# Altium schematic sheet 涂鸦灯串-20220817.SchDoc
size 508 x 342 mm
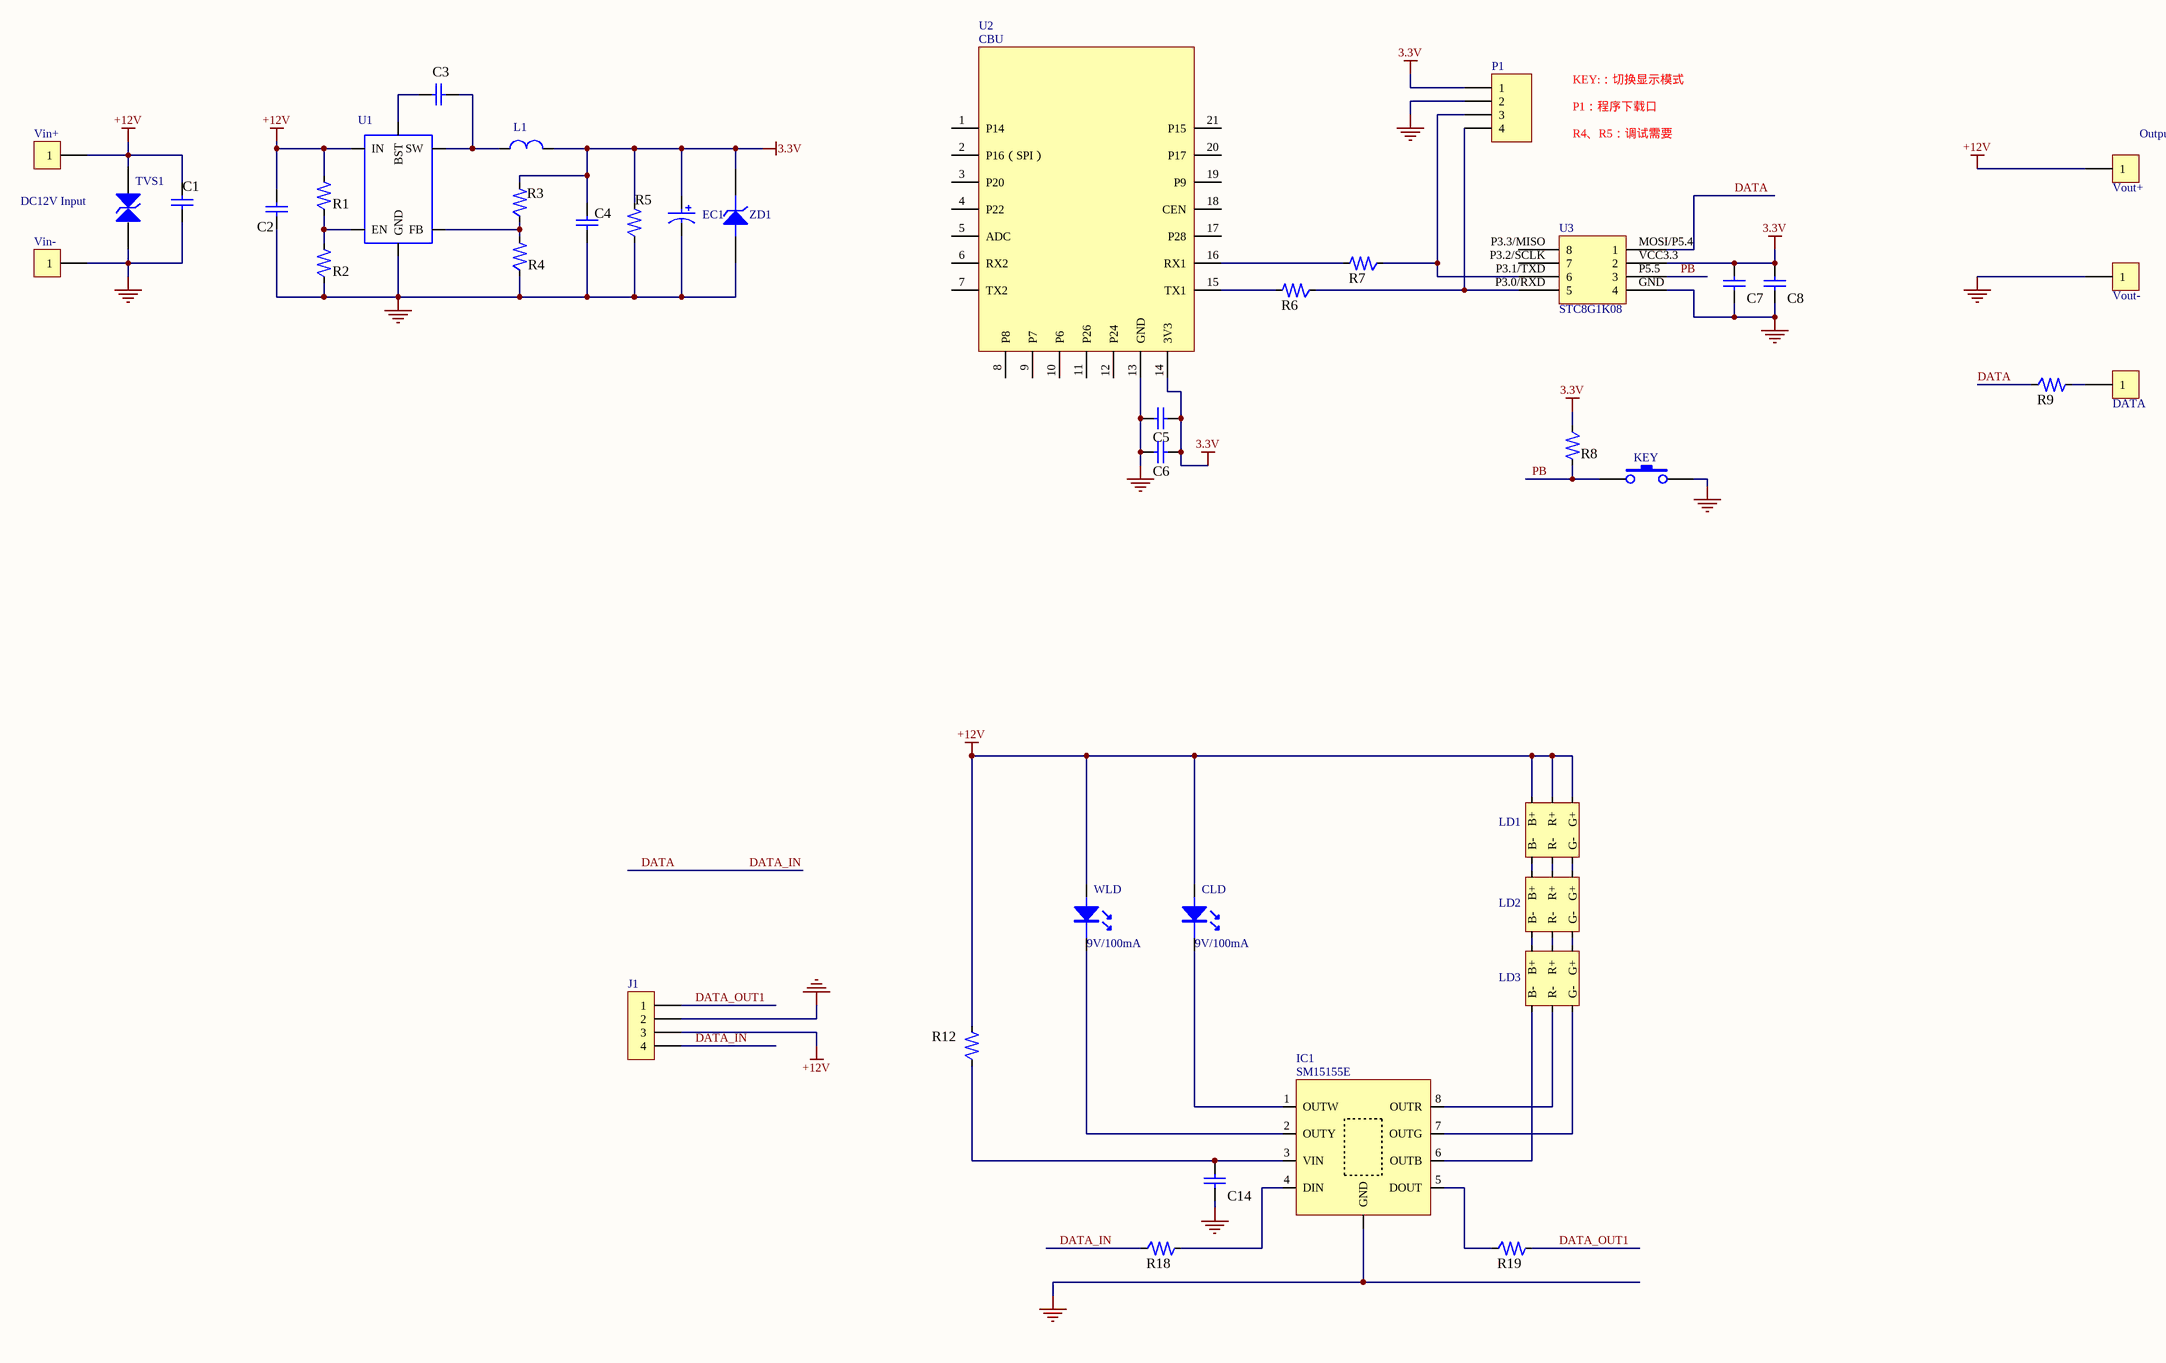
[diagram p0: 涂鸦灯串-20220817.SchDoc]

## Parts
C1  1206  [JR-1206-HC]  (value not drawn)
C2  1206  [JR-1206-HC]  (value not drawn)
C3  0805  [JR-0805-HC]  (value not drawn)
C4  0805  [JR-0805-HC]  (value not drawn)
C5  0805  [JR-0805-HC]  (value not drawn)
C6  0805  [JR-0805-HC]  (value not drawn)
C7  0805  [JR-0805-HC]  (value not drawn)
C8  0805  [JR-0805-HC]  (value not drawn)
C14  1206  [JR-1206-HC]  (value not drawn)
CLD  9V/100mA  [2835 LED-APT - CW]
DATA  CON1  [电线焊盘-1]  (value not drawn)
EC1  5*11  [JR-Φ6.3*11mm电解电容-3D]  (value not drawn)
IC1  SM15155E  [ESOP-8-3D]
J1  CON4  (value not drawn)
KEY  SW-PB  [6*6*15轻触开关-贴片]  (value not drawn)
L1  TRANSM  [VCD54]  (value not drawn)
LD1  RGB 3528  [Elega-2835-RGB-4-3D]  (value not drawn)
LD2  RGB 3528  [Elega-2835-RGB-4-3D]  (value not drawn)
LD3  RGB 3528  [Elega-2835-RGB-4-3D]  (value not drawn)
P1  Header 4H  [HDR1X4H]  (value not drawn)
R1  0805  [JR-0805-HR]  (value not drawn)
R2  0805  [JR-0805-HR]  (value not drawn)
R3  0805  [JR-0805-HR]  (value not drawn)
R4  0805  [JR-0805-HR]  (value not drawn)
R5  0805  [JR-0805-HR]  (value not drawn)
R6  0805  [JR-0805-HR]  (value not drawn)
R7  0805  [JR-0805-HR]  (value not drawn)
R8  0805  [JR-0805-HR]  (value not drawn)
R9  0805  [JR-0805-HR]  (value not drawn)
R12  1206  [JR-1206-HR]  (value not drawn)
R18  1206  [JR-0805-HR]  (value not drawn)
R19  1206  [JR-0805-HR]  (value not drawn)
TVS1  (no value)  [DO-214AC-W]
U1  MP2457GJ  [SOT23-6-3D]  (value not drawn)
U2  CBU  [CBU]
U3  STC8G1K08
Vin+  CON1  [电线焊盘-1]  (value not drawn)
Vin-  CON1  [电线焊盘-1]  (value not drawn)
Vout+  CON1  [电线焊盘-1]  (value not drawn)
Vout-  CON1  [电线焊盘-1]  (value not drawn)
WLD  9V/100mA  [2835 LED-APT - WW]
ZD1  (no value)  [SOD123]

## Nets
3.3V: C4.2 C5.2 C6.2 C7.2 C8.2 EC1.1 L1.2 P1.1 R3.1 R5.1 R8.2 U2.14(3V3) U3.VCC3.3(2) ZD1.2(K)
+12V: C1.1 C2.1 CLD.1 J1.3 LD1.1(G+) LD1.2(R+) LD1.3(B+) R1.1 R12.1 TVS1.2(K) U1.5(IN) Vin+.1 Vout+.1 WLD.1
GND: C1.2 C2.2 C4.1 C5.1 C6.1 C7.1 C8.1 C14.1 EC1.2 IC1.9(GND) J1.2 KEY.2 P1.2 R2.2 R4.2 R5.2 TVS1.1(A) U1.2(GND) U2.13(GND) U3.GND(4) Vin-.1 Vout-.1 ZD1.1(A)
DATA: J1.4 R9.2 R18.2 U3.MOSI/P5.4(1)  [also labelled DATA_IN]
DATA_OUT1: J1.1 R19.1
PB: KEY.1 R8.1 U3.P5.5(3)
NetC3_1: C3.1 L1.1 U1.6(SW)
NetC3_2: C3.2 U1.1(BST)
NetC14_2: C14.2 IC1.3(VIN) R12.2
NetCLD_2: CLD.2 IC1.1(OUTW)
NetDATA_1: DATA.1 R9.1
NetIC1_2: IC1.2(OUTY) WLD.2
NetIC1_4: IC1.4(DIN) R18.1
NetIC1_5: IC1.5(DOUT) R19.2
NetIC1_6: IC1.6(OUTB) LD3.4(B-)
NetIC1_7: IC1.7(OUTG) LD3.6(G-)
NetIC1_8: IC1.8(OUTR) LD3.5(R-)
NetLD1_4: LD1.4(B-) LD2.3(B+)
NetLD1_5: LD1.5(R-) LD2.2(R+)
NetLD1_6: LD1.6(G-) LD2.1(G+)
NetLD2_4: LD2.4(B-) LD3.3(B+)
NetLD2_5: LD2.5(R-) LD3.2(R+)
NetLD2_6: LD2.6(G-) LD3.1(G+)
NetP1_3: P1.3 R7.2 U3.P3.1/TXD(6)
NetP1_4: P1.4 R6.2 U3.P3.0/RXD(5)
NetR1_2: R1.2 R2.1 U1.4(EN)
NetR3_2: R3.2 R4.1 U1.3(FB)
NetR6_1: R6.1 U2.15(TX1)
NetR7_1: R7.1 U2.16(RX1)

Not connected (* = marked no-connect by the designer): U2 1(P14) 2(P16（SPI）) 3(P20) 4(P22) 5(ADC) 6(RX2) 7(TX2) 8(P8) 9(P7) 10(P6) 11(P26) 12(P24) 17(P28) 18(CEN) 19(P9) 20(P17) 21(P15); U3 P3.2/SCLK(7) P3.3/MISO(8)

## Notes on the sheet
- KEY:：切换显示模式
- P1：程序下载口
- R4、R5：调试需要
- (near Vout+) Output
- DC12V Input

## Library data of the parts
C1-C8 C14 = Cap SMT: Ceramic Capacitor
CLD WLD = LED
DATA Vin+ Vin- Vout+ Vout- = CON1: Connector
EC1 = ELECTRO
J1 = CON4: Connector
P1 = Header 4H: Header, 4-Pin, Right Angle; LatestRevisionDate: 17-Jul-2002; LatestRevisionNote: Re-released for DXP Platform.; Publisher: Altium Limited
R1-R9 R12 R18 R19 = RES_1
TVS1 = ZENER3_1: Zener Diode
U1 = IC3
ZD1 = ZENER3: Zener Diode